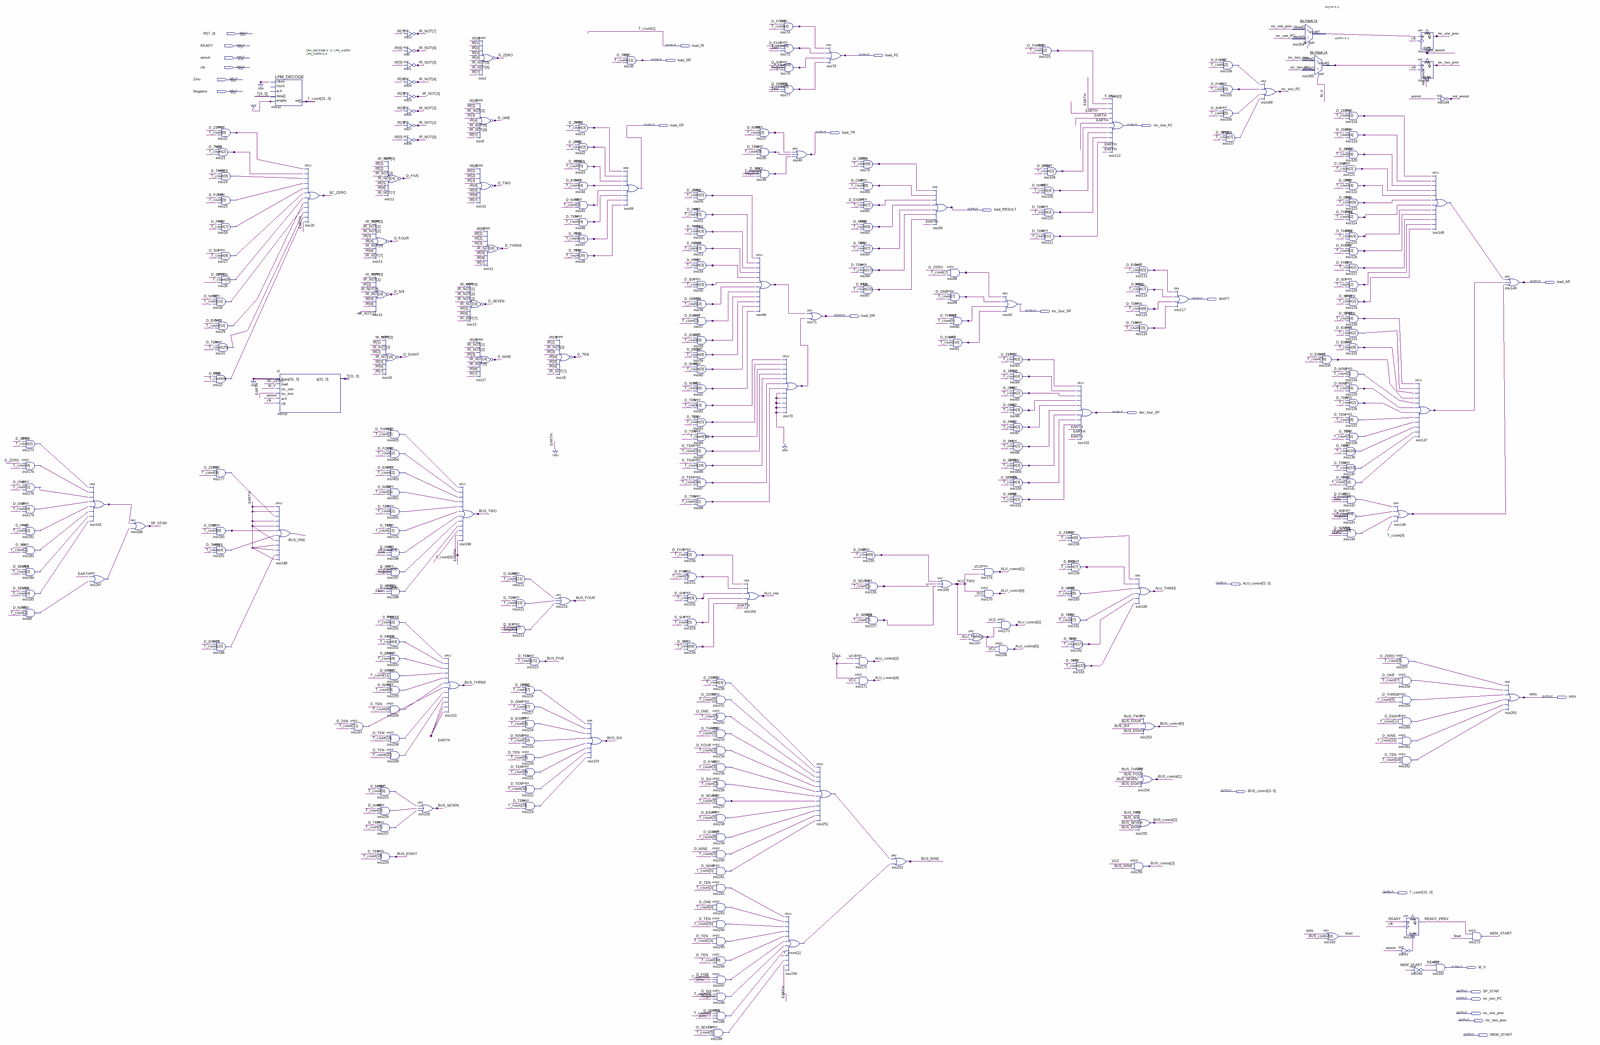
[diagram p0: schematic sheet, whole]
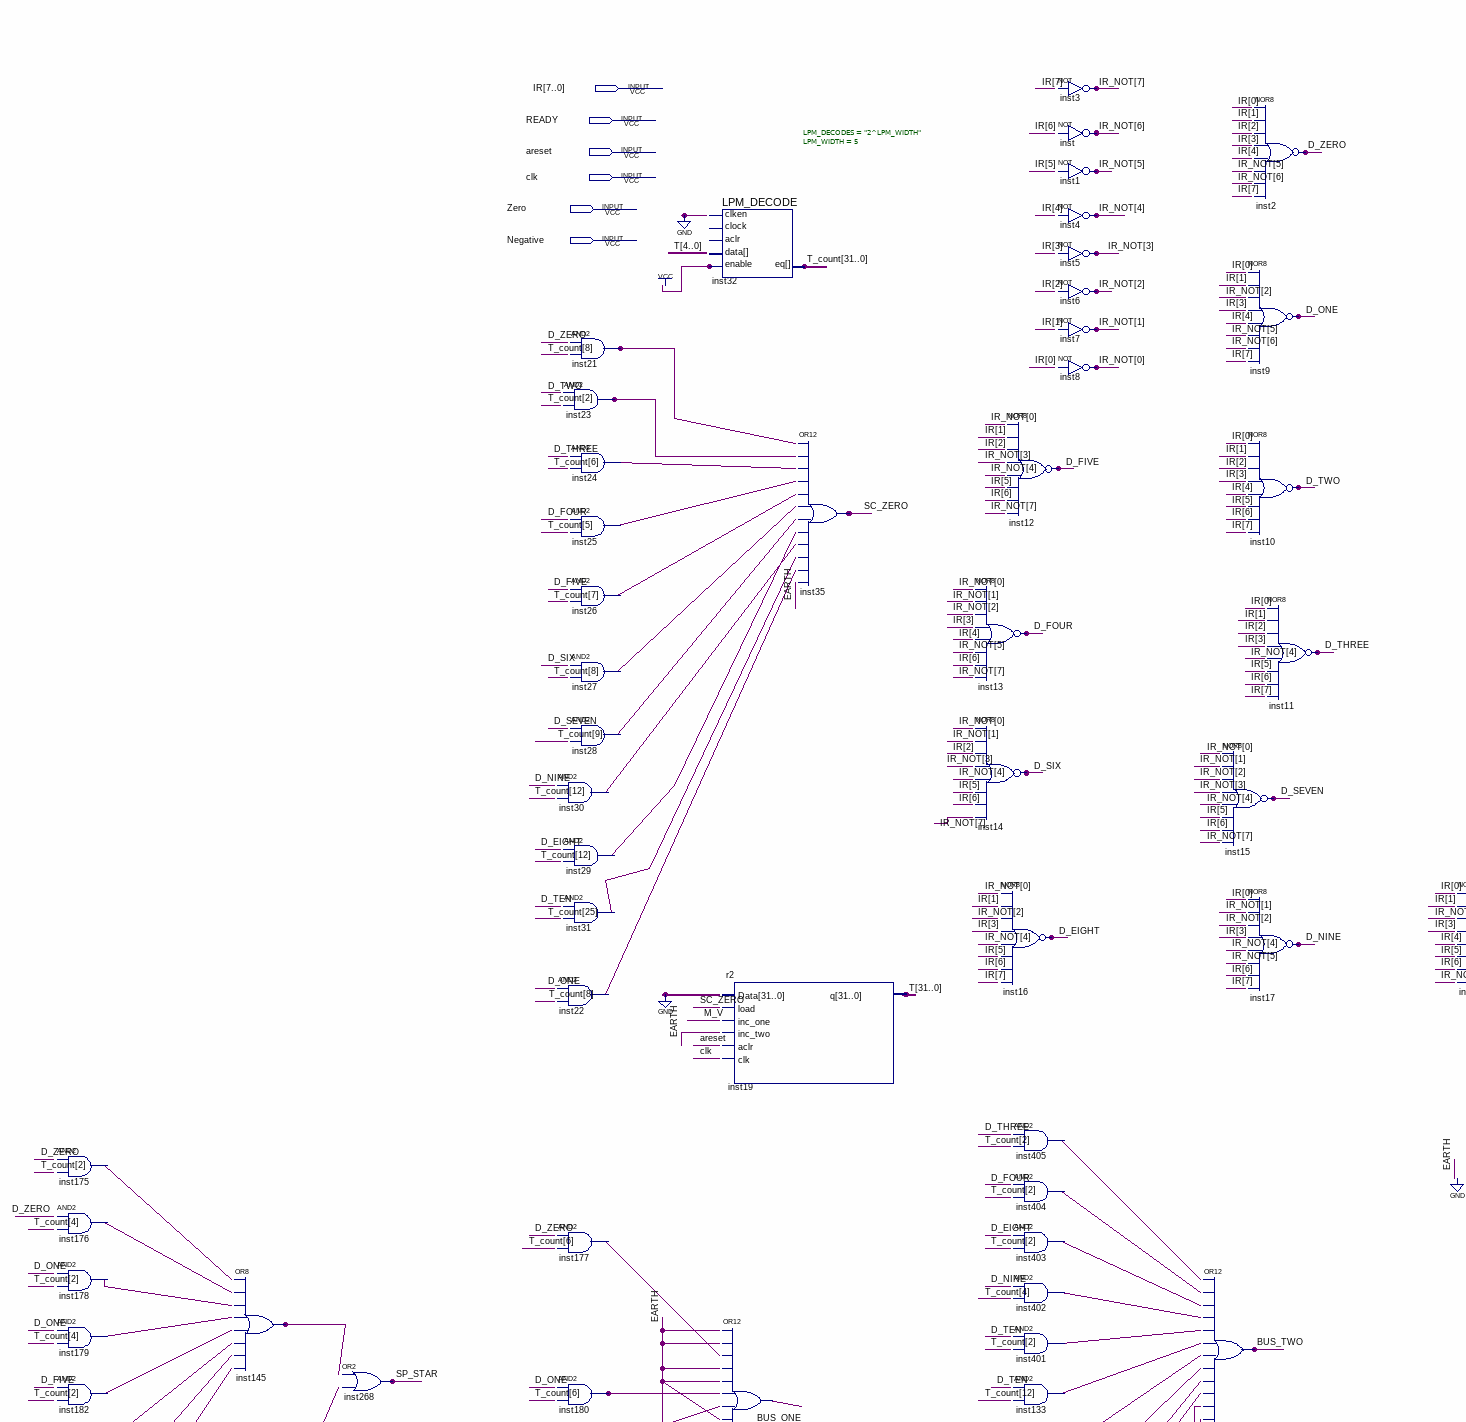
[diagram p1: schematic sheet, upper left part]
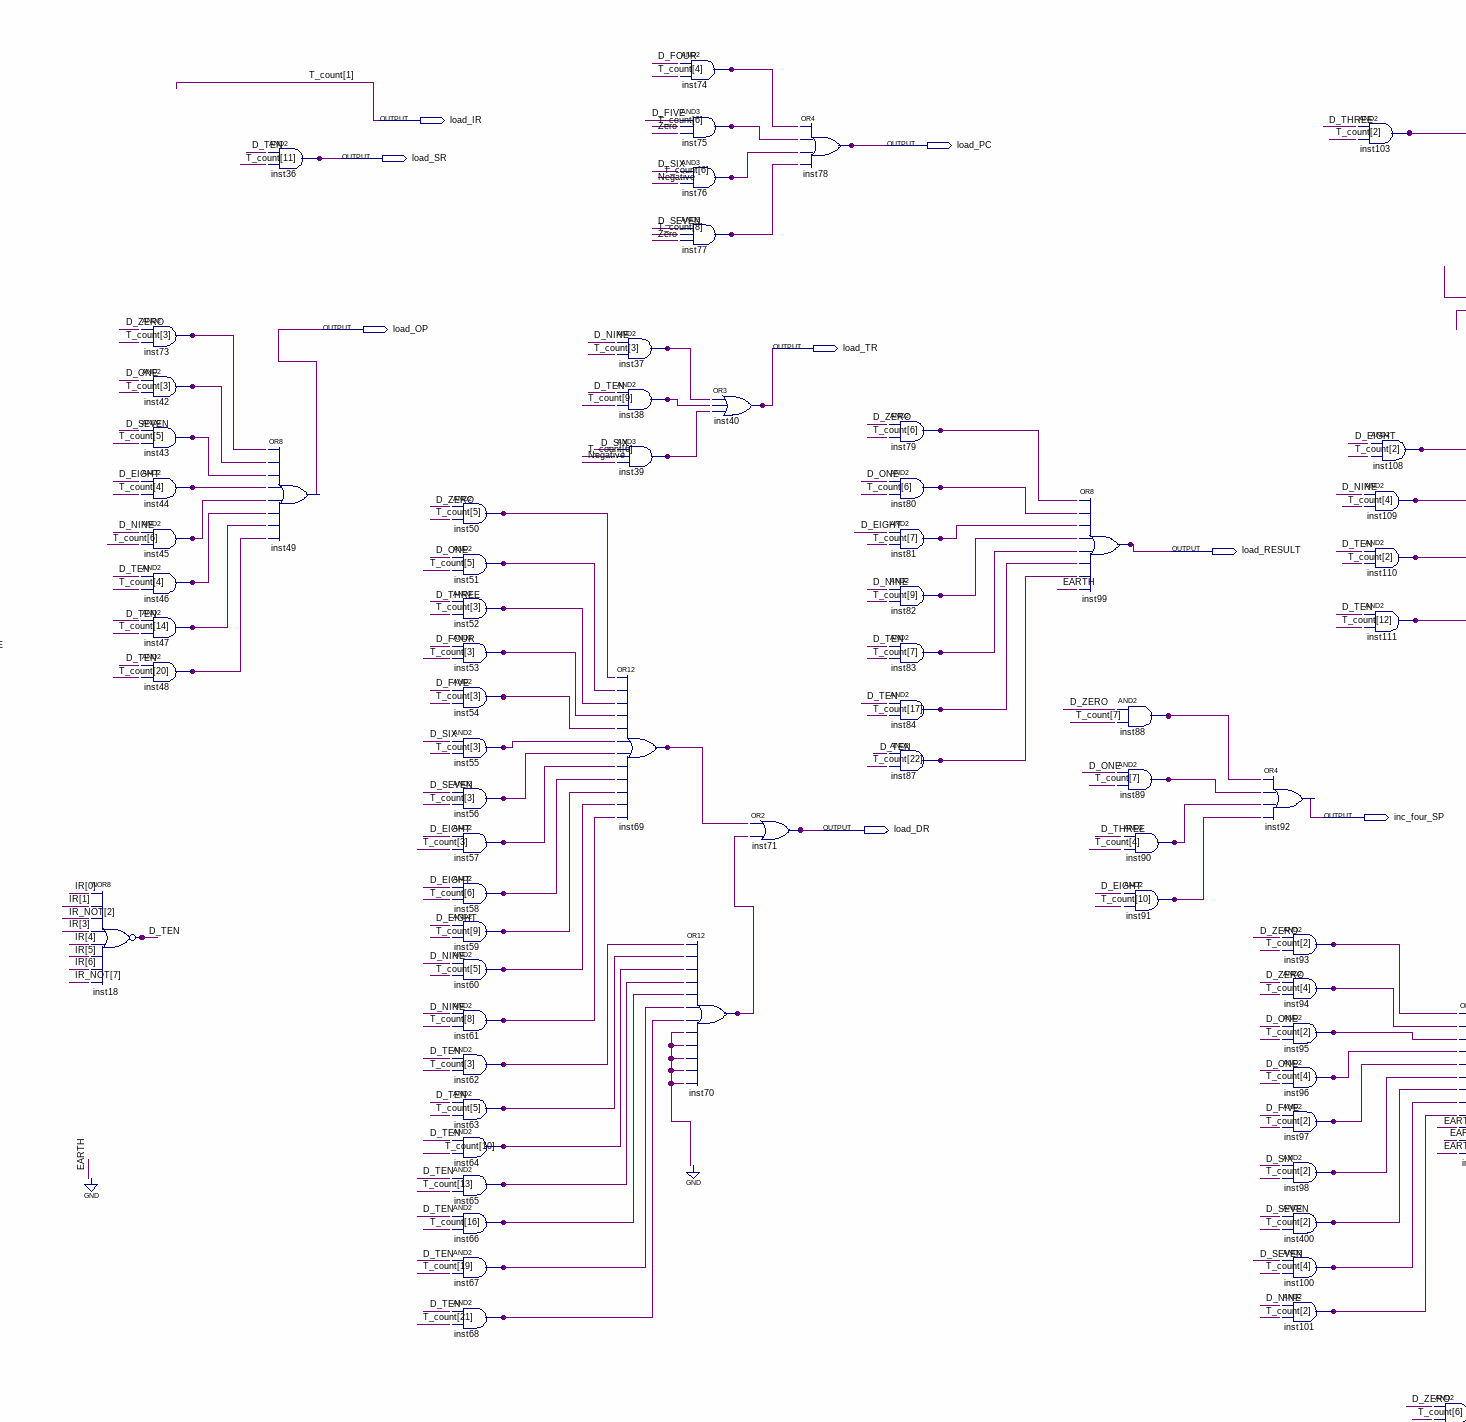
[diagram p2: schematic sheet, upper centre part]
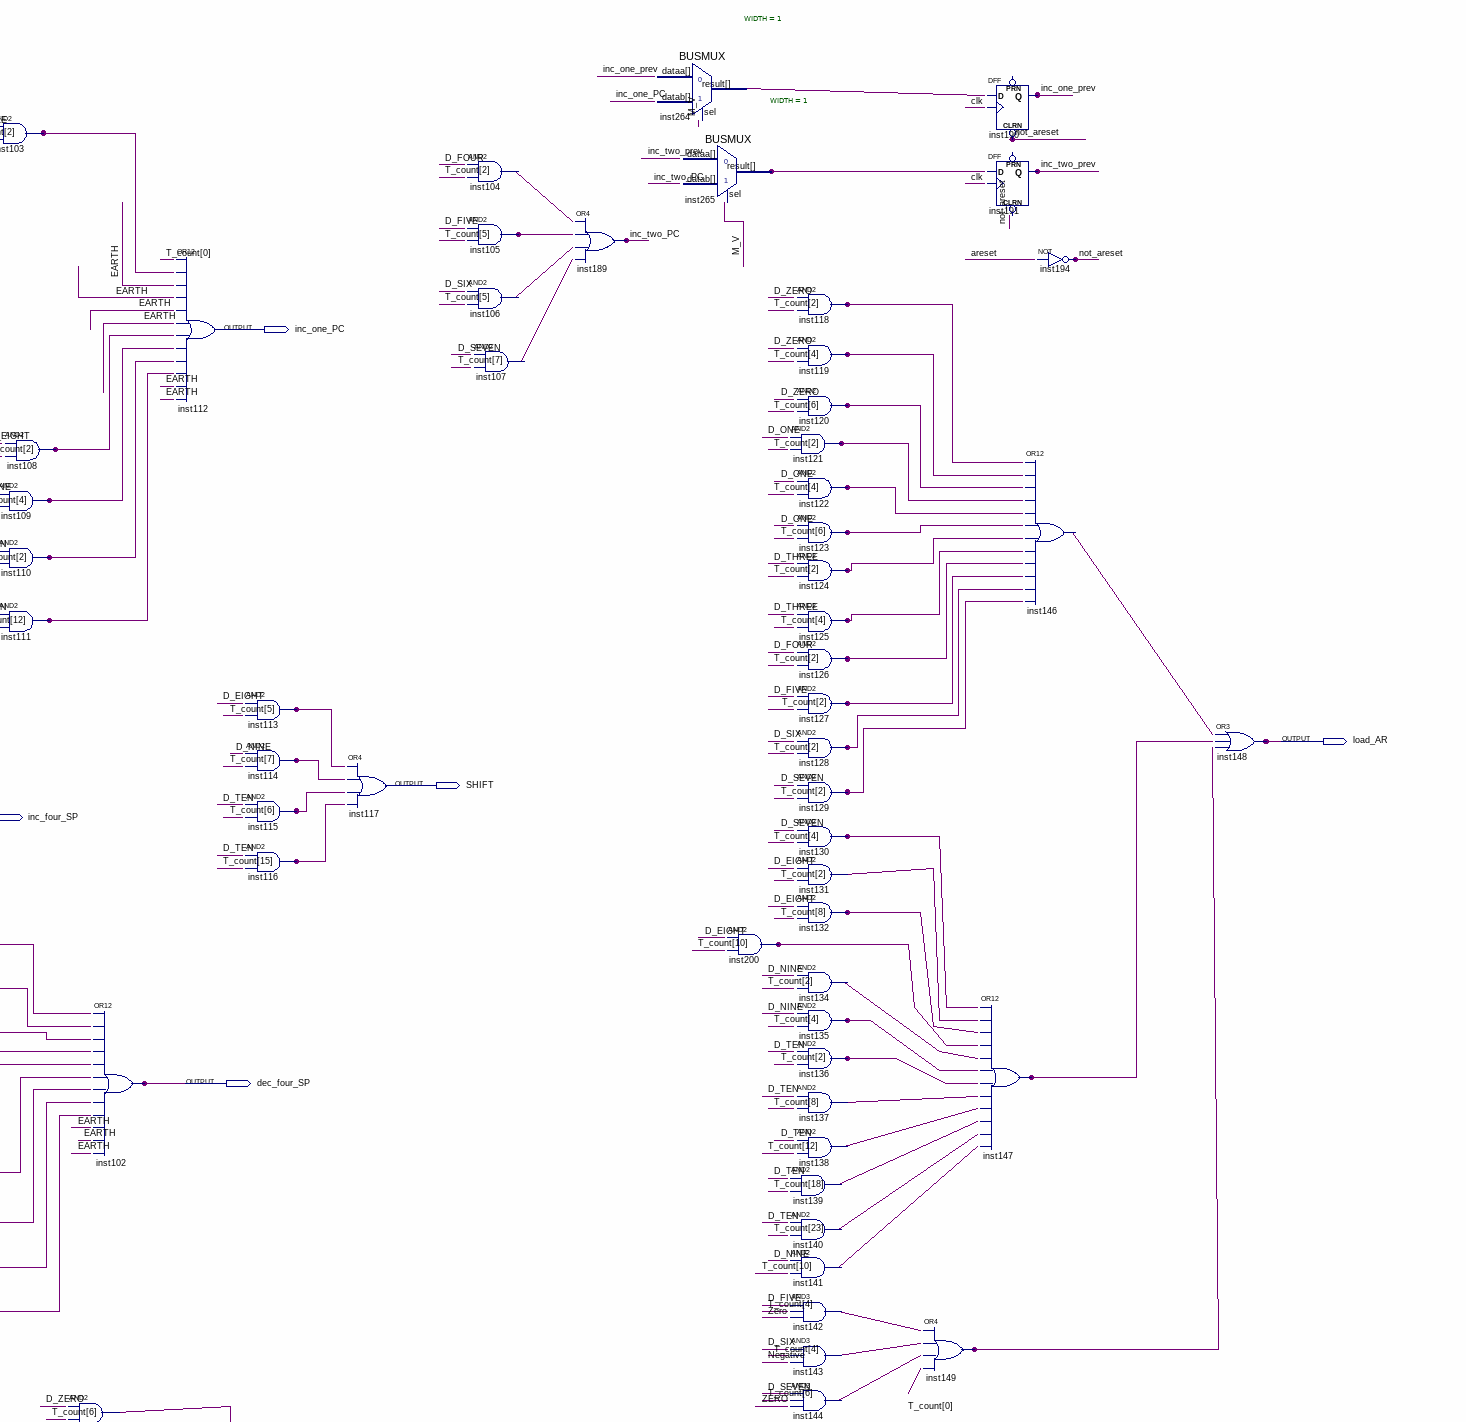
[diagram p3: schematic sheet, upper right part]
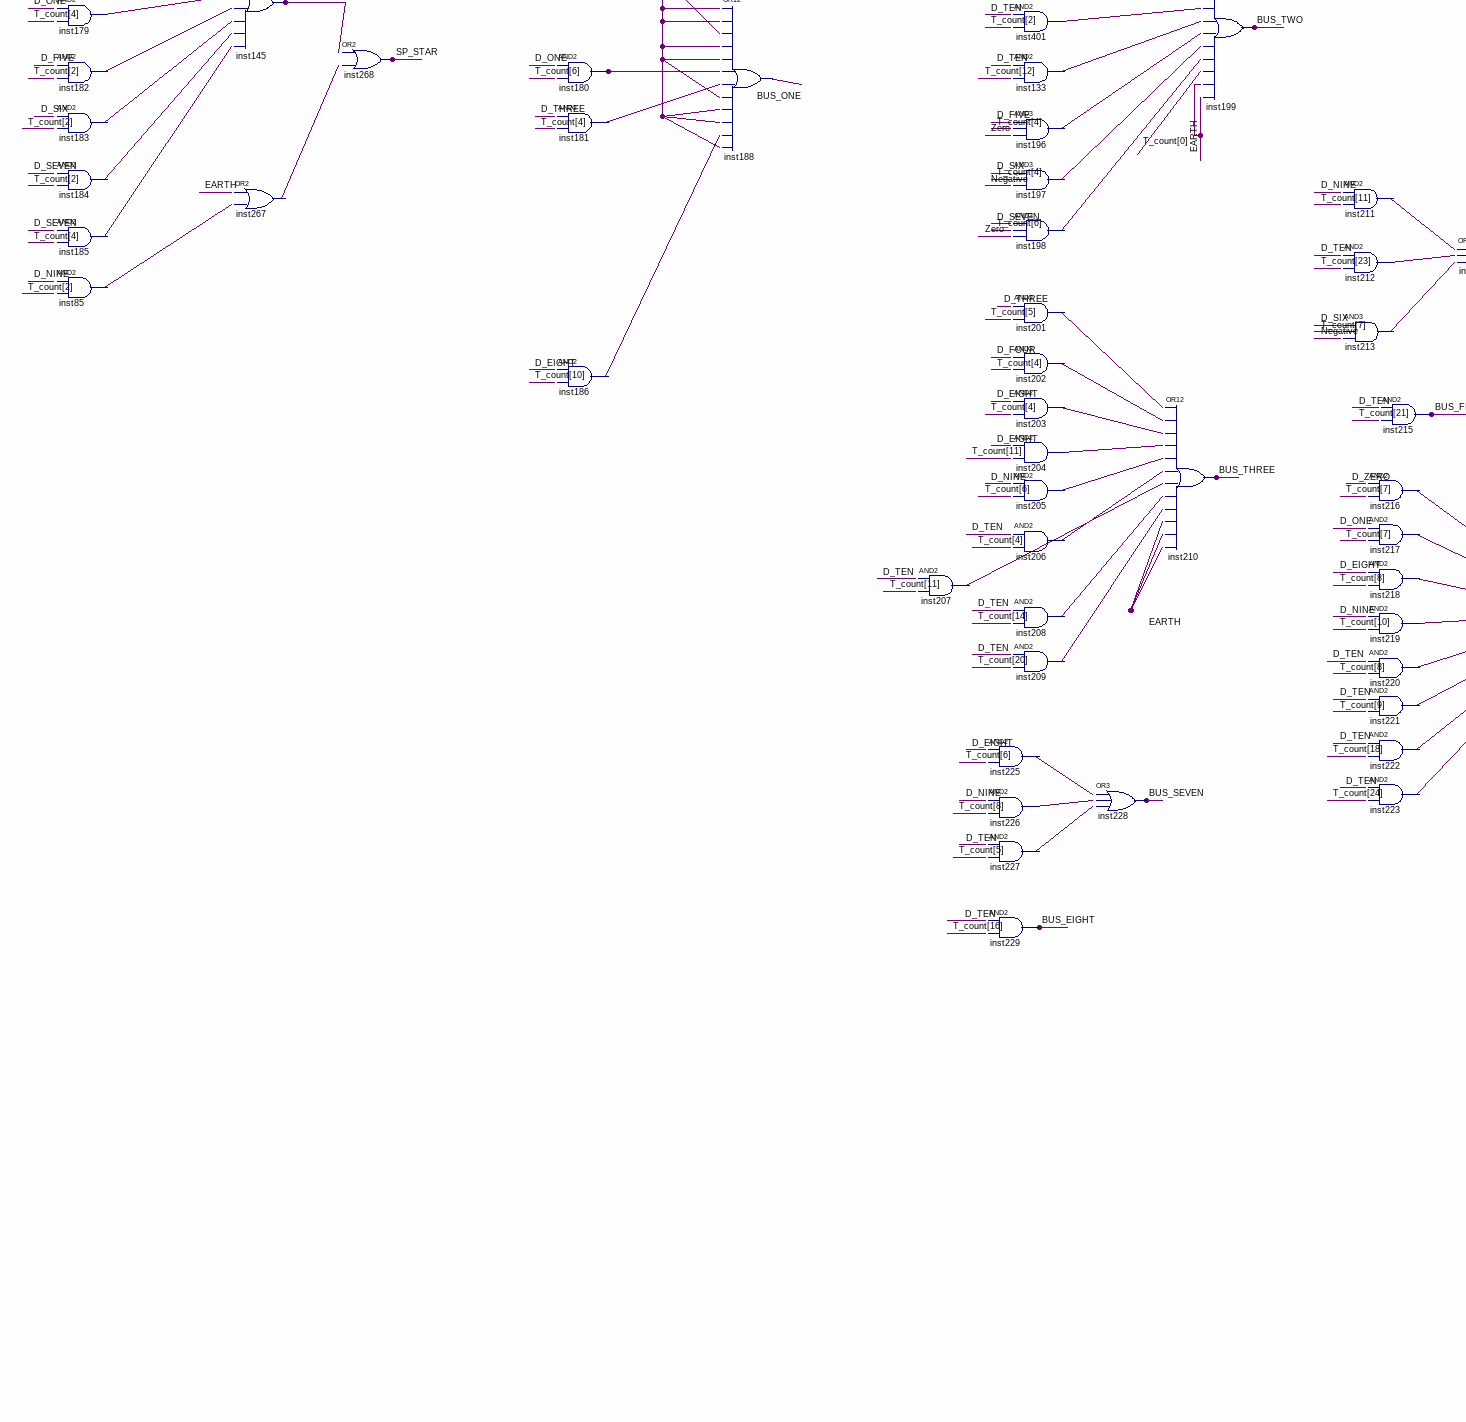
[diagram p4: schematic sheet, lower left part]
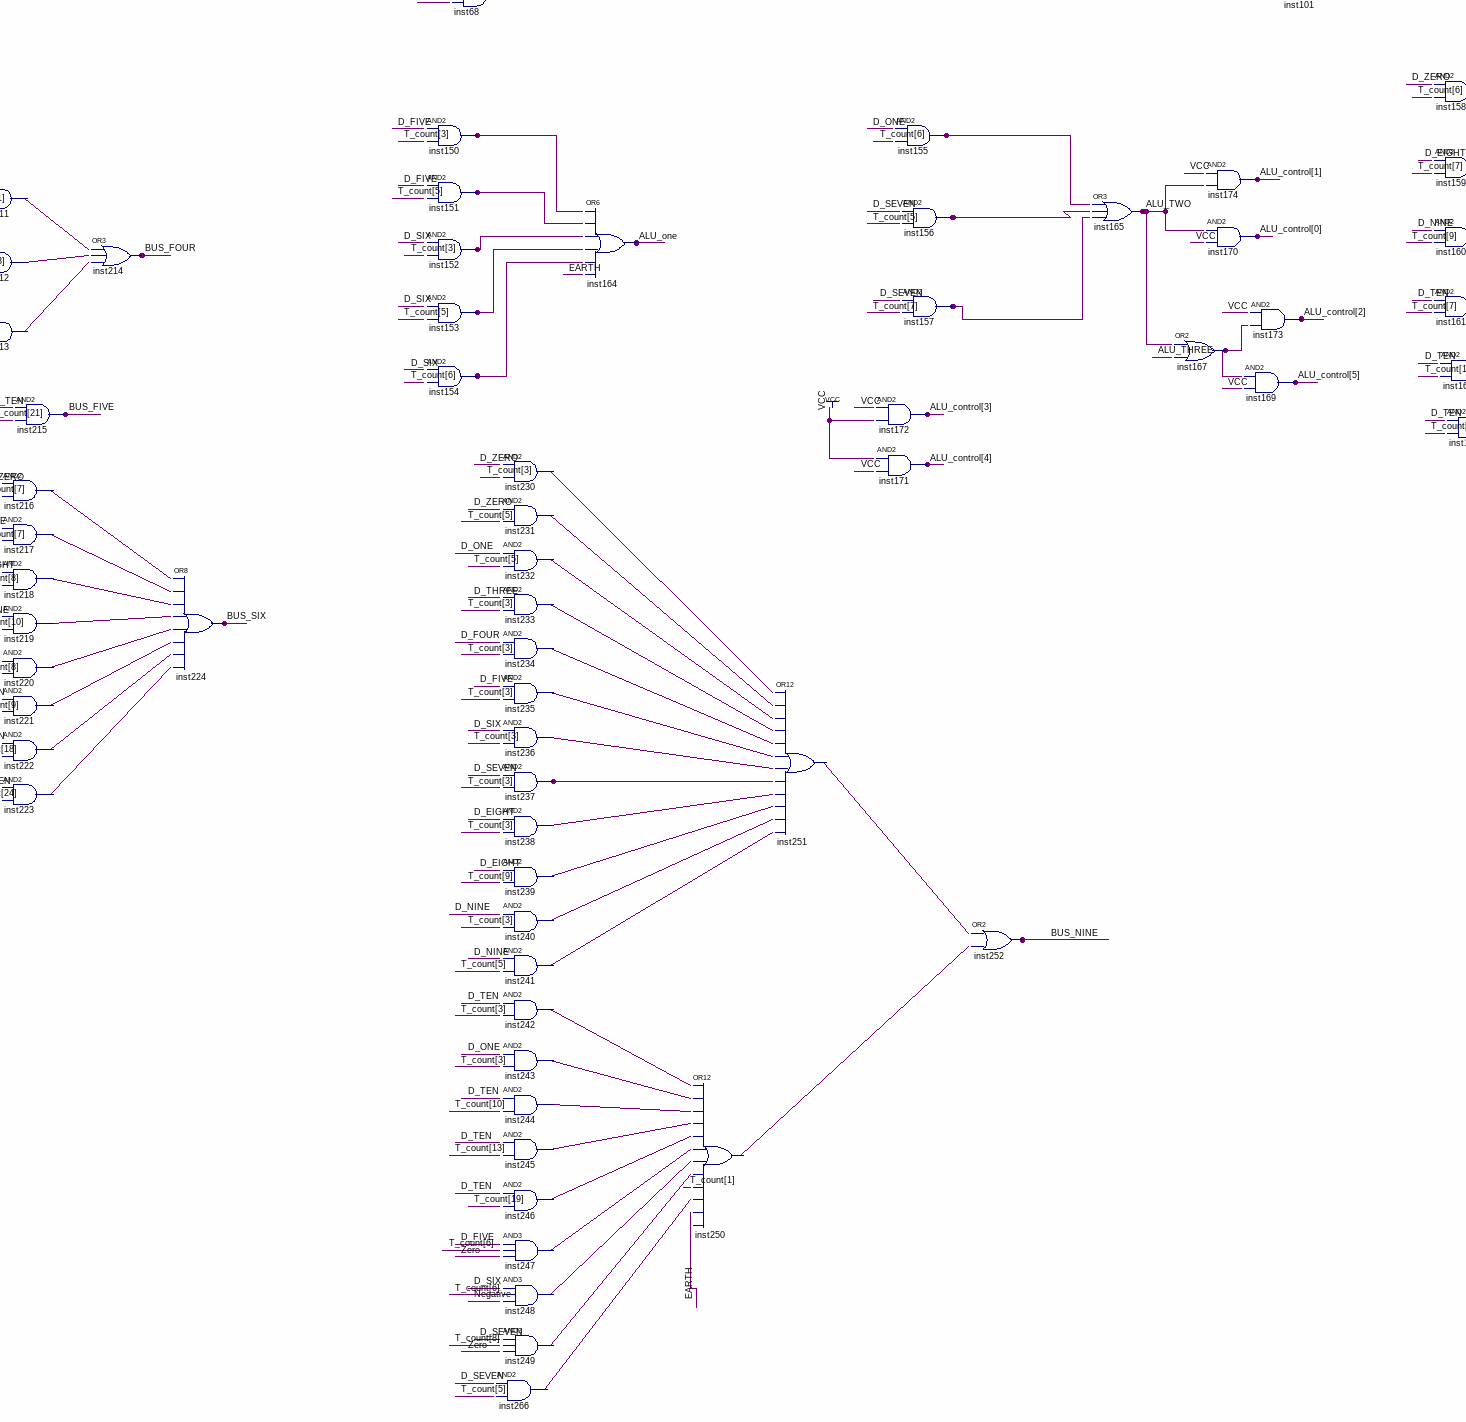
[diagram p5: schematic sheet, lower centre part]
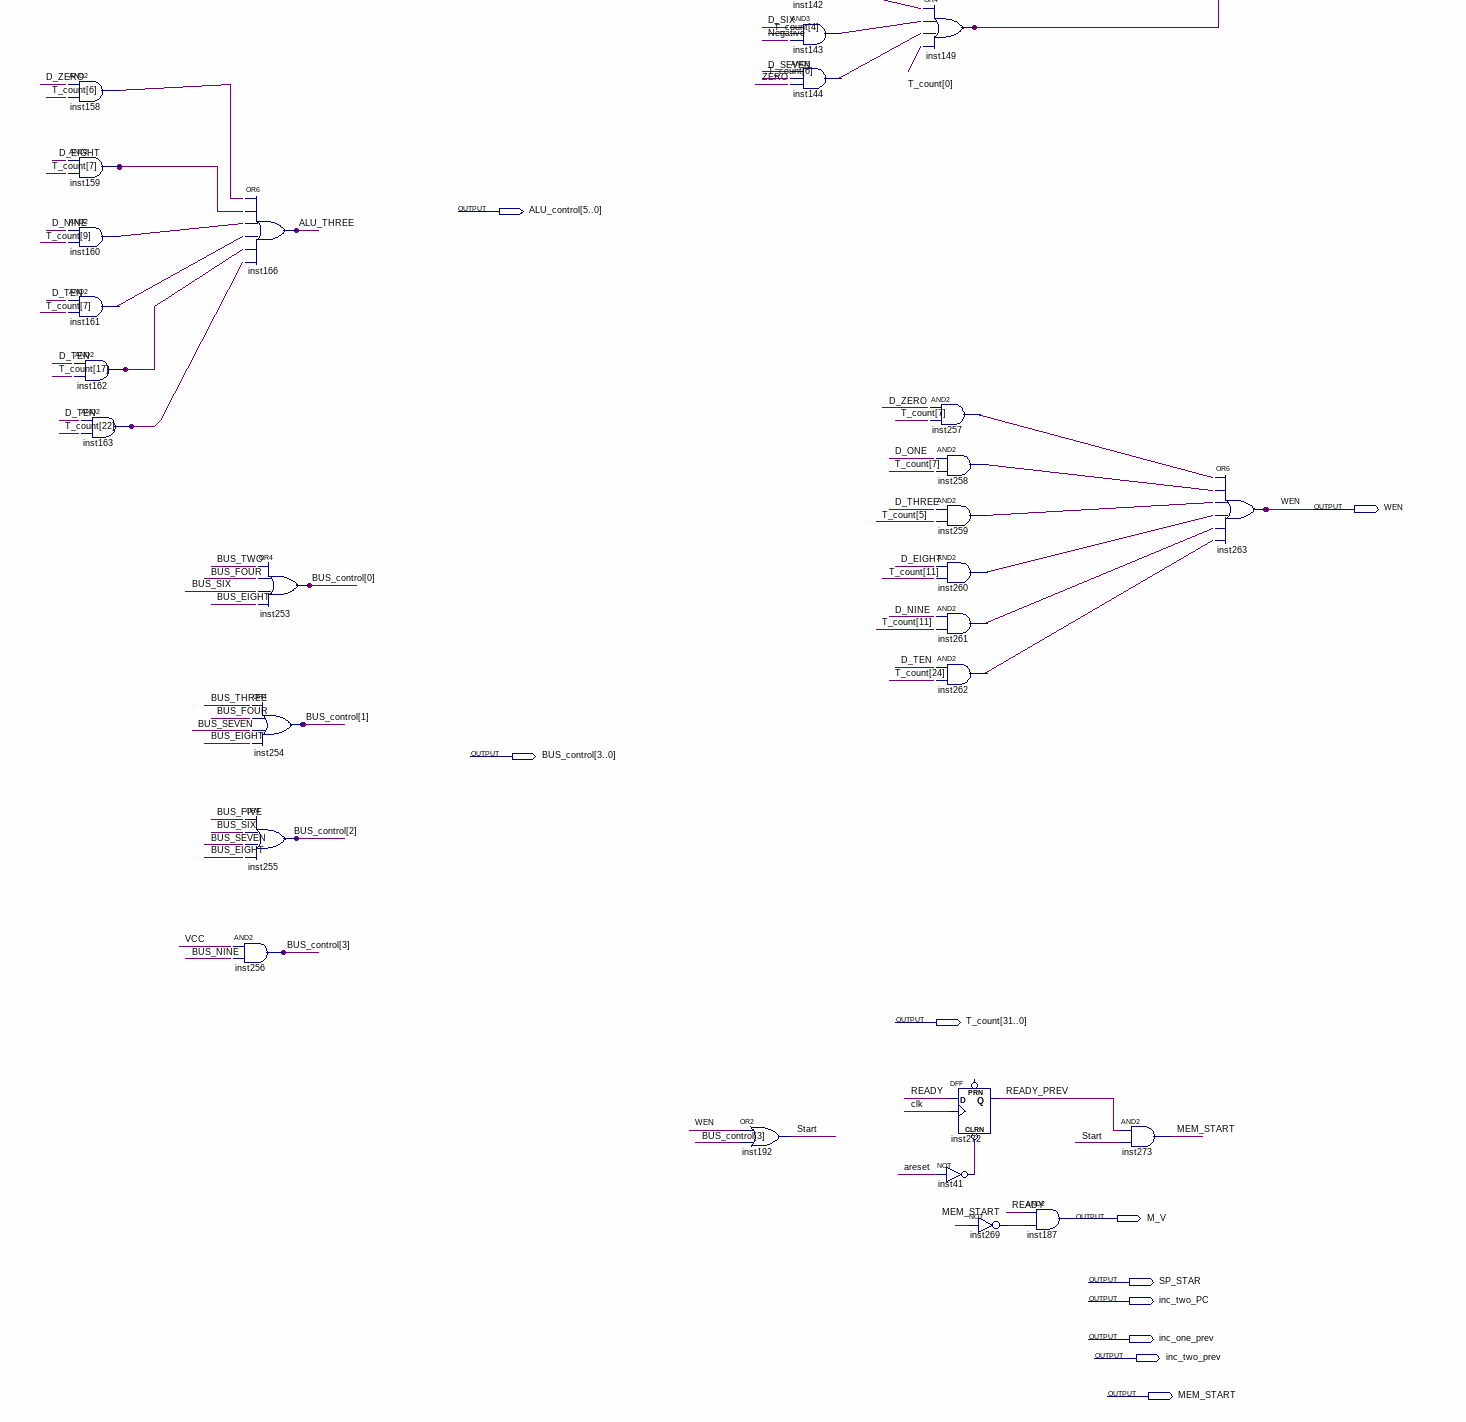
[diagram p6: schematic sheet, lower right part]
// Quartus schematic copy_control_v1.bdf as structural Verilog: 270 symbols, 28 pins
module copy_control_v1 (
  input  [7:0] IR,
  input  READY,
  input  areset,
  input  clk,
  input  Zero,
  input  Negative,
  output load_IR,
  output load_PC,
  output load_SR,
  output load_OP,
  output inc_one_PC,
  output load_TR,
  output load_RESULT,
  output load_AR,
  output SHIFT,
  output inc_four_SP,
  output load_DR,
  output dec_four_SP,
  output [5:0] ALU_control,
  output WEN,
  output [3:0] BUS_control,
  output [31:0] T_count,
  output M_V,
  output SP_STAR,
  output inc_two_PC,
  output inc_one_prev,
  output inc_two_prev,
  output MEM_START
);

  wire ALU_one, ALU_THREE, ALU_TWO, BUS_EIGHT, BUS_FIVE, BUS_FOUR, BUS_NINE, BUS_SEVEN, BUS_SIX, BUS_THREE,
       BUS_TWO, D_EIGHT, D_FIVE, D_FOUR, D_NINE, D_ONE, D_SEVEN, D_SIX, D_TEN, D_THREE, D_TWO, D_ZERO,
       inst21_out, inst23_out, inst37_out, inst38_out, inst39_out, inst41_out, inst42_out, inst43_out,
       inst44_out, inst45_out, inst46_out, inst47_out, inst48_out, inst50_out, inst51_out, inst52_out,
       inst53_out, inst54_out, inst55_out, inst56_out, inst57_out, inst58_out, inst59_out, inst60_out,
       inst61_out, inst62_out, inst63_out, inst64_out, inst65_out, inst66_out, inst67_out, inst68_out,
       inst69_out, inst70_out, inst73_out, inst74_out, inst75_out, inst76_out, inst77_out, inst79_out,
       inst80_out, inst81_out, inst82_out, inst83_out, inst84_out, inst87_out, inst88_out, inst89_out,
       inst90_out, inst91_out, inst93_out, inst94_out, inst95_out, inst96_out, inst97_out, inst98_out,
       inst100_out, inst101_out, inst103_out, inst105_out, inst108_out, inst109_out, inst110_out,
       inst111_out, inst113_out, inst114_out, inst115_out, inst116_out, inst118_out, inst119_out,
       inst120_out, inst121_out, inst122_out, inst123_out, inst124_out, inst125_out, inst126_out,
       inst127_out, inst128_out, inst129_out, inst130_out, inst132_out, inst135_out, inst136_out,
       inst145_out, inst147_out, inst149_out, inst150_out, inst151_out, inst152_out, inst153_out,
       inst154_out, inst155_out, inst156_out, inst157_out, inst159_out, inst162_out, inst163_out,
       inst167_out, inst180_out, inst200_out, inst237_out, inst265_result, inst269_out, inst400_out,
       not_areset, READY_PREV, SC_ZERO, Start, undriven;
  wire [7:0] IR_NOT;
  wire [31:0] T;

  // AND2 inst175 is placed but not wired
  // AND2 inst176 is placed but not wired
  // AND2 inst178 is placed but not wired
  // AND2 inst179 is placed but not wired
  // AND2 inst182 is placed but not wired
  // AND2 inst183 is placed but not wired
  // AND2 inst184 is placed but not wired
  // AND2 inst185 is placed but not wired
  // AND2 inst85 is placed but not wired
  // OR8 inst145 has open pins: IN1=open, IN2=open, IN3=open, IN4=open, IN5=open, IN6=open, IN7=open, IN8=open, OUT=inst145_out
  // OR2 inst267 is placed but not wired
  // OR2 inst268 has open pins: IN1=open, IN2=open, OUT=SP_STAR
  // AND2 inst21 has open pins: IN1=open, IN2=open, OUT=inst21_out
  // AND2 inst23 has open pins: IN1=open, IN2=open, OUT=inst23_out
  // AND2 inst24 is placed but not wired
  // AND2 inst25 is placed but not wired
  // AND2 inst26 is placed but not wired
  // AND2 inst27 is placed but not wired
  // AND2 inst28 is placed but not wired
  // AND2 inst30 is placed but not wired
  // AND2 inst29 is placed but not wired
  // AND2 inst31 is placed but not wired
  // AND2 inst22 is placed but not wired
  // AND2 inst177 is placed but not wired
  // AND2 inst180 has open pins: IN1=open, IN2=open, OUT=inst180_out
  // AND2 inst181 is placed but not wired
  // AND2 inst186 is placed but not wired
  LPM_DECODE #(.LPM_DECODES("2^LPM_WIDTH"), .LPM_WIDTH(5)) inst32 (
    .enable(undriven), .eq({T_count[31:2], load_IR, T_count[0]}));  // open: data, clken, clock, aclr
  r2 inst19 (.q(T));  // open: Data, load, inc_one, inc_two, aclr, clk
  // OR12 inst188 is placed but not wired
  // OR12 inst35 has open pins: IN1=open, IN2=open, IN3=open, IN4=open, IN5=open, IN6=open, IN7=open, IN8=open, IN9=open, IN10=open, IN11=open, IN12=open, OUT=SC_ZERO
  // AND2 inst207 is placed but not wired
  // NOR8 inst13 has open pins: IN1=open, IN2=open, IN3=open, IN4=open, IN5=open, IN6=open, IN7=open, IN8=open, OUT=D_FOUR
  // NOR8 inst14 has open pins: IN1=open, IN2=open, IN3=open, IN4=open, IN5=open, IN6=open, IN7=open, IN8=open, OUT=D_SIX
  // NOR8 inst16 has open pins: IN1=open, IN2=open, IN3=open, IN4=open, IN5=open, IN6=open, IN7=open, IN8=open, OUT=D_EIGHT
  // AND2 inst225 is placed but not wired
  // AND2 inst226 is placed but not wired
  // AND2 inst227 is placed but not wired
  // AND2 inst229 has open pins: IN1=open, IN2=open, OUT=BUS_EIGHT
  // NOR8 inst12 has open pins: IN1=open, IN2=open, IN3=open, IN4=open, IN5=open, IN6=open, IN7=open, IN8=open, OUT=D_FIVE
  // AND2 inst405 is placed but not wired
  // AND2 inst404 is placed but not wired
  // AND2 inst403 is placed but not wired
  // AND2 inst402 is placed but not wired
  // AND2 inst401 is placed but not wired
  // AND2 inst133 is placed but not wired
  // AND3 inst196 is placed but not wired
  // AND3 inst197 is placed but not wired
  // AND3 inst198 is placed but not wired
  // AND2 inst201 is placed but not wired
  // AND2 inst202 is placed but not wired
  // AND2 inst203 is placed but not wired
  // AND2 inst204 is placed but not wired
  // AND2 inst205 is placed but not wired
  // AND2 inst206 is placed but not wired
  // AND2 inst208 is placed but not wired
  // AND2 inst209 is placed but not wired
  // NOT inst3 has open pins: IN=open, OUT=IR_NOT[7]
  // NOT inst has open pins: IN=open, OUT=IR_NOT[6]
  // NOT inst1 has open pins: IN=open, OUT=IR_NOT[5]
  // NOT inst4 has open pins: IN=open, OUT=IR_NOT[4]
  // NOT inst5 has open pins: IN=open, OUT=IR_NOT[3]
  // NOT inst6 has open pins: IN=open, OUT=IR_NOT[2]
  // NOT inst7 has open pins: IN=open, OUT=IR_NOT[1]
  // NOT inst8 has open pins: IN=open, OUT=IR_NOT[0]
  // OR3 inst228 has open pins: IN1=open, IN2=open, IN3=open, OUT=BUS_SEVEN
  // OR12 inst199 has open pins: IN1=open, IN2=open, IN3=open, IN4=open, IN5=open, IN6=open, IN7=open, IN8=open, IN9=open, IN10=open, IN11=open, IN12=open, OUT=BUS_TWO
  // OR12 inst210 has open pins: IN1=open, IN2=open, IN3=open, IN4=open, IN5=open, IN6=open, IN7=open, IN8=open, IN9=open, IN10=open, IN11=open, IN12=open, OUT=BUS_THREE
  // NOR8 inst2 has open pins: IN1=open, IN2=open, IN3=open, IN4=open, IN5=open, IN6=open, IN7=open, IN8=open, OUT=D_ZERO
  // NOR8 inst9 has open pins: IN1=open, IN2=open, IN3=open, IN4=open, IN5=open, IN6=open, IN7=open, IN8=open, OUT=D_ONE
  // NOR8 inst10 has open pins: IN1=open, IN2=open, IN3=open, IN4=open, IN5=open, IN6=open, IN7=open, IN8=open, OUT=D_TWO
  // NOR8 inst15 has open pins: IN1=open, IN2=open, IN3=open, IN4=open, IN5=open, IN6=open, IN7=open, IN8=open, OUT=D_SEVEN
  // NOR8 inst17 has open pins: IN1=open, IN2=open, IN3=open, IN4=open, IN5=open, IN6=open, IN7=open, IN8=open, OUT=D_NINE
  // NOR8 inst11 has open pins: IN1=open, IN2=open, IN3=open, IN4=open, IN5=open, IN6=open, IN7=open, IN8=open, OUT=D_THREE
  // AND2 inst211 is placed but not wired
  // AND2 inst212 is placed but not wired
  // AND3 inst213 is placed but not wired
  // AND2 inst215 has open pins: IN1=open, IN2=open, OUT=BUS_FIVE
  // AND2 inst216 is placed but not wired
  // AND2 inst217 is placed but not wired
  // AND2 inst218 is placed but not wired
  // AND2 inst219 is placed but not wired
  // AND2 inst220 is placed but not wired
  // AND2 inst221 is placed but not wired
  // AND2 inst222 is placed but not wired
  // AND2 inst223 is placed but not wired
  // NOR8 inst18 has open pins: IN1=open, IN2=open, IN3=open, IN4=open, IN5=open, IN6=open, IN7=open, IN8=open, OUT=D_TEN
  // OR3 inst214 has open pins: IN1=open, IN2=open, IN3=open, OUT=BUS_FOUR
  // AND2 inst73 has open pins: IN1=open, IN2=open, OUT=inst73_out
  // AND2 inst42 has open pins: IN1=open, IN2=open, OUT=inst42_out
  // AND2 inst43 has open pins: IN1=open, IN2=open, OUT=inst43_out
  // AND2 inst44 has open pins: IN1=open, IN2=open, OUT=inst44_out
  // AND2 inst45 has open pins: IN1=open, IN2=open, OUT=inst45_out
  // AND2 inst46 has open pins: IN1=open, IN2=open, OUT=inst46_out
  // AND2 inst47 has open pins: IN1=open, IN2=open, OUT=inst47_out
  // AND2 inst48 has open pins: IN1=open, IN2=open, OUT=inst48_out
  // OR8 inst224 has open pins: IN1=open, IN2=open, IN3=open, IN4=open, IN5=open, IN6=open, IN7=open, IN8=open, OUT=BUS_SIX
  // AND2 inst36 has open pins: IN1=open, IN2=open, OUT=load_SR
  // OR8 inst49 is placed but not wired
  // AND2 inst150 has open pins: IN1=open, IN2=open, OUT=inst150_out
  // AND2 inst151 has open pins: IN1=open, IN2=open, OUT=inst151_out
  // AND2 inst152 has open pins: IN1=open, IN2=open, OUT=inst152_out
  // AND2 inst153 has open pins: IN1=open, IN2=open, OUT=inst153_out
  // AND2 inst154 has open pins: IN1=open, IN2=open, OUT=inst154_out
  // AND2 inst50 has open pins: IN1=open, IN2=open, OUT=inst50_out
  // AND2 inst51 has open pins: IN1=open, IN2=open, OUT=inst51_out
  // AND2 inst52 has open pins: IN1=open, IN2=open, OUT=inst52_out
  // AND2 inst53 has open pins: IN1=open, IN2=open, OUT=inst53_out
  // AND2 inst54 has open pins: IN1=open, IN2=open, OUT=inst54_out
  // AND2 inst55 has open pins: IN1=open, IN2=open, OUT=inst55_out
  // AND2 inst56 has open pins: IN1=open, IN2=open, OUT=inst56_out
  // AND2 inst57 has open pins: IN1=open, IN2=open, OUT=inst57_out
  // AND2 inst58 has open pins: IN1=open, IN2=open, OUT=inst58_out
  // AND2 inst59 has open pins: IN1=open, IN2=open, OUT=inst59_out
  // AND2 inst60 has open pins: IN1=open, IN2=open, OUT=inst60_out
  // AND2 inst61 has open pins: IN1=open, IN2=open, OUT=inst61_out
  // AND2 inst62 has open pins: IN1=open, IN2=open, OUT=inst62_out
  // AND2 inst63 has open pins: IN1=open, IN2=open, OUT=inst63_out
  // AND2 inst64 has open pins: IN1=open, IN2=open, OUT=inst64_out
  // AND2 inst65 has open pins: IN1=open, IN2=open, OUT=inst65_out
  // AND2 inst66 has open pins: IN1=open, IN2=open, OUT=inst66_out
  // AND2 inst67 has open pins: IN1=open, IN2=open, OUT=inst67_out
  // AND2 inst68 has open pins: IN1=open, IN2=open, OUT=inst68_out
  // AND2 inst266 is placed but not wired
  // AND2 inst230 is placed but not wired
  // AND2 inst231 is placed but not wired
  // AND2 inst232 is placed but not wired
  // AND2 inst233 is placed but not wired
  // AND2 inst234 is placed but not wired
  // AND2 inst235 is placed but not wired
  // AND2 inst236 is placed but not wired
  // AND2 inst237 has open pins: IN1=open, IN2=open, OUT=inst237_out
  // AND2 inst238 is placed but not wired
  // AND2 inst239 is placed but not wired
  // AND2 inst240 is placed but not wired
  // AND2 inst241 is placed but not wired
  // AND2 inst242 is placed but not wired
  // AND2 inst243 is placed but not wired
  // AND2 inst244 is placed but not wired
  // AND2 inst245 is placed but not wired
  // AND2 inst246 is placed but not wired
  // AND3 inst247 is placed but not wired
  // AND3 inst248 is placed but not wired
  // AND3 inst249 is placed but not wired
  // OR6 inst164 has open pins: IN1=open, IN2=open, IN3=open, IN4=open, IN5=open, IN6=open, OUT=ALU_one
  // AND2 inst37 has open pins: IN1=open, IN2=open, OUT=inst37_out
  // AND2 inst38 has open pins: IN1=open, IN2=open, OUT=inst38_out
  // AND3 inst39 has open pins: IN1=open, IN2=open, IN3=open, OUT=inst39_out
  // OR12 inst69 has open pins: IN1=open, IN2=open, IN3=open, IN4=open, IN5=open, IN6=open, IN7=open, IN8=open, IN9=open, IN10=open, IN11=open, IN12=open, OUT=inst69_out
  // AND2 inst74 has open pins: IN1=open, IN2=open, OUT=inst74_out
  // AND3 inst75 has open pins: IN1=open, IN2=open, IN3=open, OUT=inst75_out
  // AND3 inst76 has open pins: IN1=open, IN2=open, IN3=open, OUT=inst76_out
  // AND3 inst77 has open pins: IN1=open, IN2=open, IN3=open, OUT=inst77_out
  // OR12 inst70 has open pins: IN1=open, IN2=open, IN3=open, IN4=open, IN5=open, IN6=open, IN7=open, IN8=open, IN9=open, IN10=open, IN11=open, IN12=open, OUT=inst70_out
  // OR12 inst250 is placed but not wired
  // OR3 inst40 has open pins: IN1=open, IN2=open, IN3=open, OUT=load_TR
  // OR2 inst71 has open pins: IN1=open, IN2=open, OUT=load_DR
  // OR4 inst78 has open pins: IN1=open, IN2=open, IN3=open, IN4=open, OUT=load_PC
  // OR12 inst251 is placed but not wired
  // AND2 inst79 has open pins: IN1=open, IN2=open, OUT=inst79_out
  // AND2 inst80 has open pins: IN1=open, IN2=open, OUT=inst80_out
  // AND2 inst81 has open pins: IN1=open, IN2=open, OUT=inst81_out
  // AND2 inst82 has open pins: IN1=open, IN2=open, OUT=inst82_out
  // AND2 inst83 has open pins: IN1=open, IN2=open, OUT=inst83_out
  // AND2 inst84 has open pins: IN1=open, IN2=open, OUT=inst84_out
  // AND2 inst87 has open pins: IN1=open, IN2=open, OUT=inst87_out
  // AND2 inst155 has open pins: IN1=open, IN2=open, OUT=inst155_out
  // AND2 inst156 has open pins: IN1=open, IN2=open, OUT=inst156_out
  // AND2 inst157 has open pins: IN1=open, IN2=open, OUT=inst157_out
  // AND2 inst172 has open pins: IN1=open, IN2=open, OUT=ALU_control[3]
  // AND2 inst171 has open pins: IN1=open, IN2=open, OUT=ALU_control[4]
  // OR2 inst252 has open pins: IN1=open, IN2=open, OUT=BUS_NINE
  // OR8 inst99 has open pins: IN1=open, IN2=open, IN3=open, IN4=open, IN5=open, IN6=open, IN7=open, IN8=open, OUT=load_RESULT
  // OR3 inst165 has open pins: IN1=open, IN2=open, IN3=open, OUT=ALU_TWO
  // AND2 inst88 has open pins: IN1=open, IN2=open, OUT=inst88_out
  // AND2 inst89 has open pins: IN1=open, IN2=open, OUT=inst89_out
  // AND2 inst90 has open pins: IN1=open, IN2=open, OUT=inst90_out
  // AND2 inst91 has open pins: IN1=open, IN2=open, OUT=inst91_out
  // AND2 inst174 has open pins: IN1=open, IN2=open, OUT=ALU_control[1]
  // AND2 inst170 has open pins: IN1=open, IN2=open, OUT=ALU_control[0]
  // OR2 inst167 has open pins: IN1=open, IN2=open, OUT=inst167_out
  // AND2 inst173 has open pins: IN1=open, IN2=open, OUT=ALU_control[2]
  // AND2 inst169 has open pins: IN1=open, IN2=open, OUT=ALU_control[5]
  // OR4 inst92 is placed but not wired
  // AND2 inst93 has open pins: IN1=open, IN2=open, OUT=inst93_out
  // AND2 inst94 has open pins: IN1=open, IN2=open, OUT=inst94_out
  // AND2 inst95 has open pins: IN1=open, IN2=open, OUT=inst95_out
  // AND2 inst96 has open pins: IN1=open, IN2=open, OUT=inst96_out
  // AND2 inst97 has open pins: IN1=open, IN2=open, OUT=inst97_out
  // AND2 inst98 has open pins: IN1=open, IN2=open, OUT=inst98_out
  // AND2 inst400 has open pins: IN1=open, IN2=open, OUT=inst400_out
  // AND2 inst100 has open pins: IN1=open, IN2=open, OUT=inst100_out
  // AND2 inst101 has open pins: IN1=open, IN2=open, OUT=inst101_out
  // AND2 inst103 has open pins: IN1=open, IN2=open, OUT=inst103_out
  // AND2 inst108 has open pins: IN1=open, IN2=open, OUT=inst108_out
  // AND2 inst109 has open pins: IN1=open, IN2=open, OUT=inst109_out
  // AND2 inst110 has open pins: IN1=open, IN2=open, OUT=inst110_out
  // AND2 inst111 has open pins: IN1=open, IN2=open, OUT=inst111_out
  // OR12 inst102 has open pins: IN1=open, IN2=open, IN3=open, IN4=open, IN5=open, IN6=open, IN7=open, IN8=open, IN9=open, IN10=open, IN11=open, IN12=open, OUT=dec_four_SP
  // AND2 inst158 is placed but not wired
  // AND2 inst159 has open pins: IN1=open, IN2=open, OUT=inst159_out
  // AND2 inst160 is placed but not wired
  // AND2 inst161 is placed but not wired
  // AND2 inst162 has open pins: IN1=open, IN2=open, OUT=inst162_out
  // AND2 inst163 has open pins: IN1=open, IN2=open, OUT=inst163_out
  // OR12 inst112 is placed but not wired
  // AND2 inst113 has open pins: IN1=open, IN2=open, OUT=inst113_out
  // AND2 inst114 has open pins: IN1=open, IN2=open, OUT=inst114_out
  // AND2 inst115 has open pins: IN1=open, IN2=open, OUT=inst115_out
  // AND2 inst116 has open pins: IN1=open, IN2=open, OUT=inst116_out
  // OR6 inst166 has open pins: IN1=open, IN2=open, IN3=open, IN4=open, IN5=open, IN6=open, OUT=ALU_THREE
  // OR4 inst255 has open pins: IN1=open, IN2=open, IN3=open, IN4=open, OUT=BUS_control[2]
  // AND2 inst256 has open pins: IN1=open, IN2=open, OUT=BUS_control[3]
  // OR4 inst253 has open pins: IN1=open, IN2=open, IN3=open, IN4=open, OUT=BUS_control[0]
  // OR4 inst254 has open pins: IN1=open, IN2=open, IN3=open, IN4=open, OUT=BUS_control[1]
  // OR4 inst117 is placed but not wired
  // AND2 inst104 is placed but not wired
  // AND2 inst105 has open pins: IN1=open, IN2=open, OUT=inst105_out
  // AND2 inst106 is placed but not wired
  // AND2 inst107 is placed but not wired
  // OR4 inst189 has open pins: IN1=open, IN2=open, IN3=open, IN4=open, OUT=inc_two_PC
  BUSMUX #(.WIDTH(1)) inst264 ();  // open: datab, sel, dataa, result
  BUSMUX #(.WIDTH(1)) inst265 (.result(inst265_result));  // open: datab, sel, dataa
  // AND2 inst200 has open pins: IN1=open, IN2=open, OUT=inst200_out
  or inst192 (Start, WEN, BUS_control[3]);
  // AND2 inst118 has open pins: IN1=open, IN2=open, OUT=inst118_out
  // AND2 inst119 has open pins: IN1=open, IN2=open, OUT=inst119_out
  // AND2 inst120 has open pins: IN1=open, IN2=open, OUT=inst120_out
  // AND2 inst121 has open pins: IN1=open, IN2=open, OUT=inst121_out
  // AND2 inst122 has open pins: IN1=open, IN2=open, OUT=inst122_out
  // AND2 inst123 has open pins: IN1=open, IN2=open, OUT=inst123_out
  // AND2 inst124 has open pins: IN1=open, IN2=open, OUT=inst124_out
  // AND2 inst125 has open pins: IN1=open, IN2=open, OUT=inst125_out
  // AND2 inst126 has open pins: IN1=open, IN2=open, OUT=inst126_out
  // AND2 inst127 has open pins: IN1=open, IN2=open, OUT=inst127_out
  // AND2 inst128 has open pins: IN1=open, IN2=open, OUT=inst128_out
  // AND2 inst129 has open pins: IN1=open, IN2=open, OUT=inst129_out
  // AND2 inst130 has open pins: IN1=open, IN2=open, OUT=inst130_out
  // AND2 inst131 is placed but not wired
  // AND2 inst132 has open pins: IN1=open, IN2=open, OUT=inst132_out
  // AND2 inst134 is placed but not wired
  // AND2 inst135 has open pins: IN1=open, IN2=open, OUT=inst135_out
  // AND2 inst136 has open pins: IN1=open, IN2=open, OUT=inst136_out
  // AND2 inst137 is placed but not wired
  // AND2 inst138 is placed but not wired
  // AND2 inst139 is placed but not wired
  // AND2 inst140 is placed but not wired
  // AND2 inst141 is placed but not wired
  // AND3 inst142 is placed but not wired
  // AND3 inst143 is placed but not wired
  // AND3 inst144 is placed but not wired
  // OR4 inst149 has open pins: IN1=open, IN2=open, IN3=open, IN4=open, OUT=inst149_out
  // AND2 inst257 is placed but not wired
  // AND2 inst258 is placed but not wired
  // AND2 inst259 is placed but not wired
  // AND2 inst260 is placed but not wired
  // AND2 inst261 is placed but not wired
  // AND2 inst262 is placed but not wired
  DFF inst272 (.CLRN(inst41_out), .CLK(clk), .D(READY), .Q(READY_PREV));  // open: PRN
  not inst41 (inst41_out, areset);
  DFF inst190 (.CLRN(not_areset), .Q(inc_one_prev));  // open: CLK, D, PRN
  DFF inst191 (.Q(inc_two_prev));  // open: CLRN, CLK, D, PRN
  // OR12 inst147 has open pins: IN1=open, IN2=open, IN3=open, IN4=open, IN5=open, IN6=open, IN7=open, IN8=open, IN9=open, IN10=open, IN11=open, IN12=open, OUT=inst147_out
  not inst269 (inst269_out, MEM_START);
  // NOT inst194 has open pins: IN=open, OUT=not_areset
  // OR12 inst146 is placed but not wired
  and inst187 (M_V, READY, inst269_out);
  and inst273 (MEM_START, READY_PREV, Start);
  // OR3 inst148 has open pins: IN1=open, IN2=open, IN3=open, OUT=load_AR
  // OR6 inst263 has open pins: IN1=open, IN2=open, IN3=open, IN4=open, IN5=open, IN6=open, OUT=WEN

  assign T_count[1] = load_IR;
endmodule
